# EAGLE design Esquema (EAGLE 9.6.2)
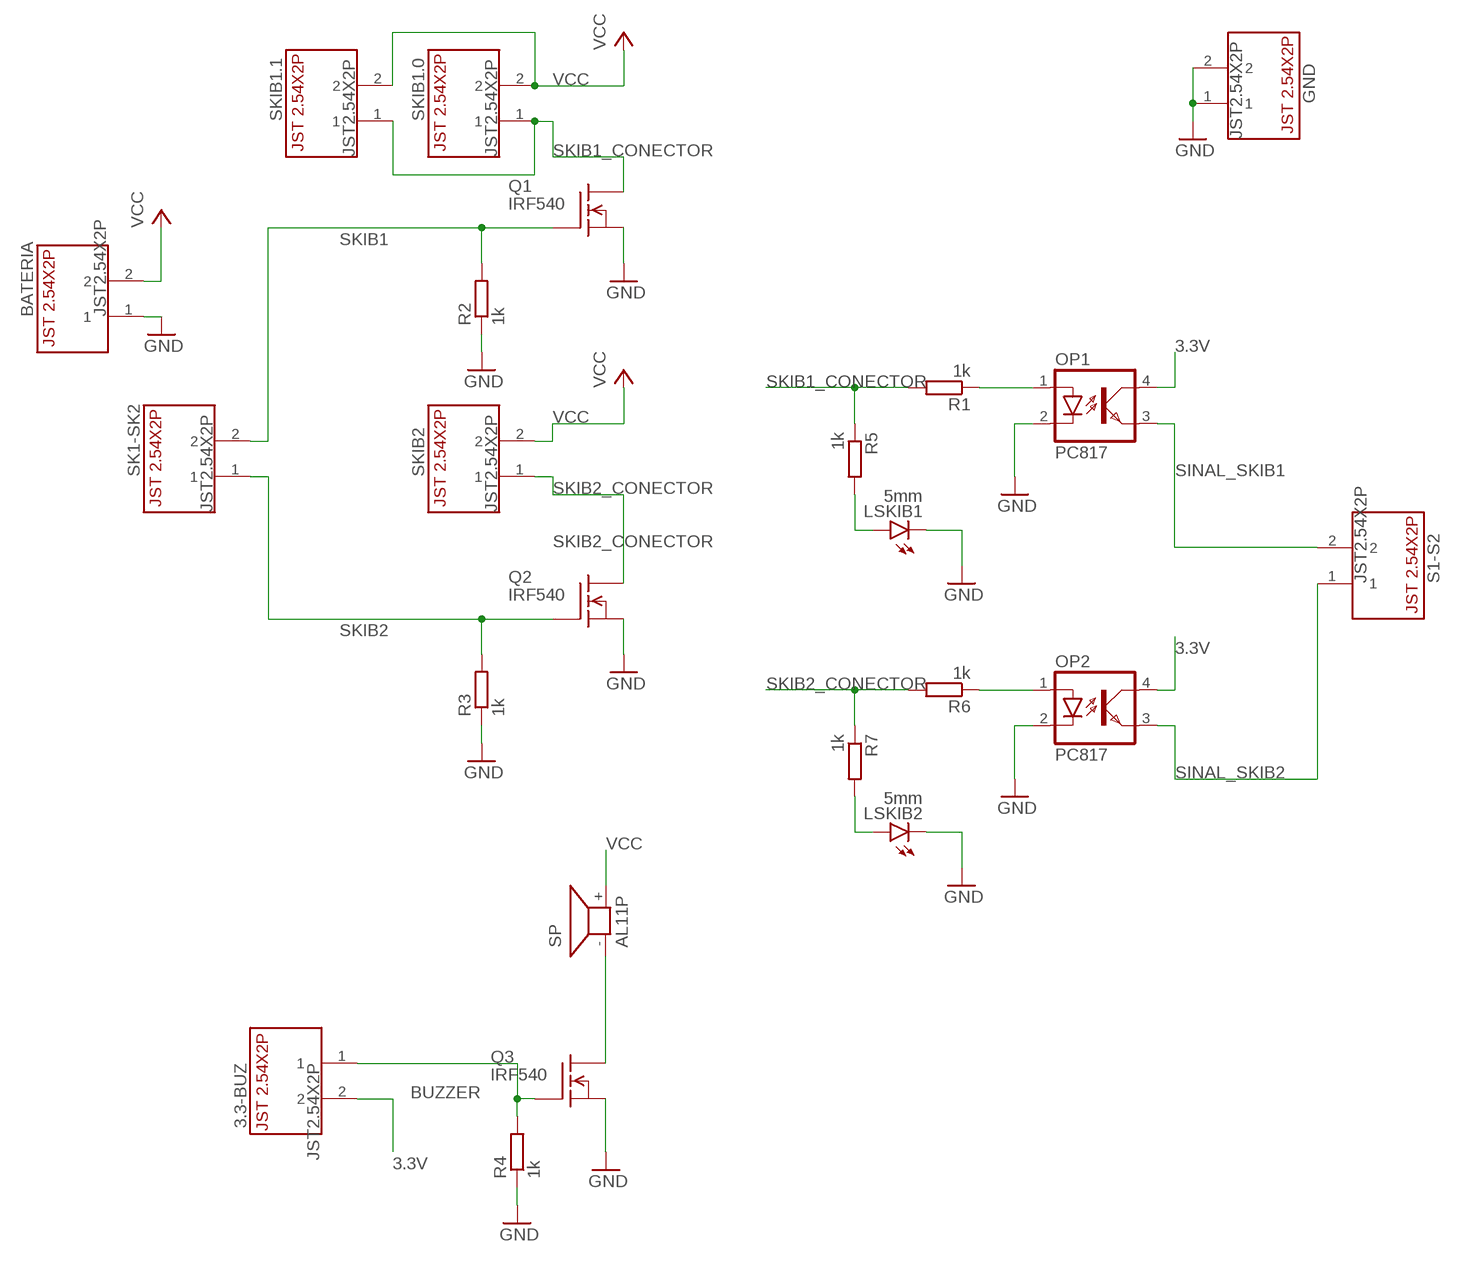
[diagram p0: schematic, sheet 1]

## Parts
3.3-BUZ  JST2.54X2P  [JST2.54X2P_FOOTPRINT]
BATERIA  JST2.54X2P  [JST2.54X2P_FOOTPRINT]
GND  JST2.54X2P  [JST2.54X2P_FOOTPRINT]
LSKIB1  5mm  LED5MM  [LED5MM]
LSKIB2  5mm  LED5MM  [LED5MM]
OP1  PC817  [DIL04]
OP2  PC817  [DIL04]
Q1  IRF540  [TO220]
Q2  IRF540  [TO220]
Q3  IRF540  [TO220]
R1  1k  R-EU_0207/10  [0207/10]
R2  1k  R-EU_0207/10  [0207/10]
R3  1k  R-EU_0207/10  [0207/10]
R4  1k  R-EU_0207/10  [0207/10]
R5  1k  R-EU_0207/10  [0207/10]
R6  1k  R-EU_0207/10  [0207/10]
R7  1k  R-EU_0207/10  [0207/10]
S1-S2  JST2.54X2P  [JST2.54X2P_FOOTPRINT]
SK1-SK2  JST2.54X2P  [JST2.54X2P_FOOTPRINT]
SKIB1.0  JST2.54X2P  [JST2.54X2P_FOOTPRINT]
SKIB1.1  JST2.54X2P  [JST2.54X2P_FOOTPRINT]
SKIB2  JST2.54X2P  [JST2.54X2P_FOOTPRINT]
SP  AL11P  [AL11P]

## Nets
3.3V: 3.3-BUZ.2 OP1.4(COL) OP2.4(COL)
BUZZER: 3.3-BUZ.1 Q3.1(G) R4.2
GND: BATERIA.1 GND.1 GND.2 LSKIB1.K(C) LSKIB2.K(C) OP1.2(C) OP2.2(C) Q1.3(S) Q2.3(S) Q3.3(S) R2.1 R3.1 R4.1
N$1: LSKIB2.A R7.2
N$2: Q3.2(D) SP.-
N$3: LSKIB1.A R5.2
N$4: OP1.1(A) R1.1
N$5: OP2.1(A) R6.1
SINAL_SKIB1: OP1.3(EMIT) S1-S2.2
SINAL_SKIB2: OP2.3(EMIT) S1-S2.1
SKIB1: Q1.1(G) R2.2 SK1-SK2.2
SKIB1_CONECTOR: Q1.2(D) R1.2 R5.1 SKIB1.0.1 SKIB1.1.1
SKIB2: Q2.1(G) R3.2 SK1-SK2.1
SKIB2_CONECTOR: Q2.2(D) R6.2 R7.1 SKIB2.1
VCC: BATERIA.2 SKIB1.0.2 SKIB1.1.2 SKIB2.2 SP.+

## Library data of the parts
3.3-BUZ BATERIA GND S1-S2 SK1-SK2 SKIB1.0 SKIB1.1 SKIB2 = CRD:JST2.54X2P: Conector JST 2 pinos (2.54mm de distância entre pinos)
LSKIB1 LSKIB2 = led-modificada:LED: LED OSRAM: - CHIPLED LG R971, LG N971, LY N971, LG Q971, LY Q971, LO R971, LY R971 LH N974, LH R974 LS Q976, LO Q976, LY Q976 LO Q996 - Hyper CHIPLED LW Q18S LB Q993, LB Q99A, LB R99A - SideLED LS A670, LO A670, LY A670, LG A670, LP A670 LB A673, LV A673, LT A673, LW A673 LH A674 LY A675 LS A676, LA A676, LO A676, LY A676, LW A676 LS A679, LY A679, LG A679 - Hyper Micro SIDELED® LS Y876, LA Y876, LO Y876, LY Y876 LT Y87S - SmartLED LW L88C, LW L88S LB L89C, LB L89S, LG L890 LS L89K, LO L89K, LY L89K LS L896, LA L896, LO L896, LY L896 - TOPLED LS T670, LO T670, LY T670, LG T670, LP T670 LSG T670, LSP T670, LSY T670, LOP T670, LYG T670 LG T671, LOG T671, LSG T671 LB T673, LV T673, LT T673, LW T673 LH T674 LS T676, LA T676, LO T676, LY T676, LB T676, LH T676, LSB T676, LW T676 LB T67C, LV T67C, LT T67C, LS T67K, LO T67K, LY T67K, LW E67C LS E67B, LA E67B, LO E67B, LY E67B, LB E67C, LV E67C, LT E67C LW T67C LS T679, LY T679, LG T679 LS T770, LO T770, LY T770, LG T770, LP T770 LB T773, LV T773, LT T773, LW T773 LH T774 LS E675, LA E675, LY E675, LS T675 LS T776, LA T776, LO T776, LY T776, LB T776 LHGB T686 LT T68C, LB T68C - Hyper Mini TOPLED® LB M676 - Mini TOPLED Santana® LG M470 LS M47K, LO M47K, LY M47K Source: http://www.osram.convergy.de LUXEON: - LUMILED® LXK2-PW12-R00, LXK2-PW12-S00, LXK2-PW14-U00, LXK2-PW14-V00 LXK2-PM12-R00, LXK2-PM12-S00, LXK2-PM14-U00 LXK2-PE12-Q00, LXK2-PE12-R00, LXK2-PE12-S00, LXK2-PE14-T00, LXK2-PE14-U00 LXK2-PB12-K00, LXK2-PB12-L00, LXK2-PB12-M00, LXK2-PB14-N00, LXK2-PB14-P00, LXK2-PB14-Q00 LXK2-PR12-L00, LXK2-PR12-M00, LXK2-PR14-Q00, LXK2-PR14-R00 LXK2-PD12-Q00, LXK2-PD12-R00, LXK2-PD12-S00 LXK2-PH12-R00, LXK2-PH12-S00 LXK2-PL12-P00, LXK2-PL12-Q00, LXK2-PL12-R00 Source: www.luxeon.com KINGBRIGHT: KA-3528ASYC Source: www.kingbright.com
OP1 OP2 = optocoupler:PC817: SHARP OPTO COUPLER; MPN: PC817X4J000F; OC_FARNELL: 9707727; OC_NEWARK: 97K7059
Q1-Q3 = transistor-fet:IRF540: N-Channel Enhancement MOSFET (HEXFET); 100V; 28A; 0,077Ohm
R1-R7 = rcl-modificada:R-EU_: RESISTOR, European symbol; SPICEPREFIX: R
SP = buzzer:AL11P: SPEAKER Source: Buerklin; OC_FARNELL: unknown; OC_NEWARK: unknown

## Board
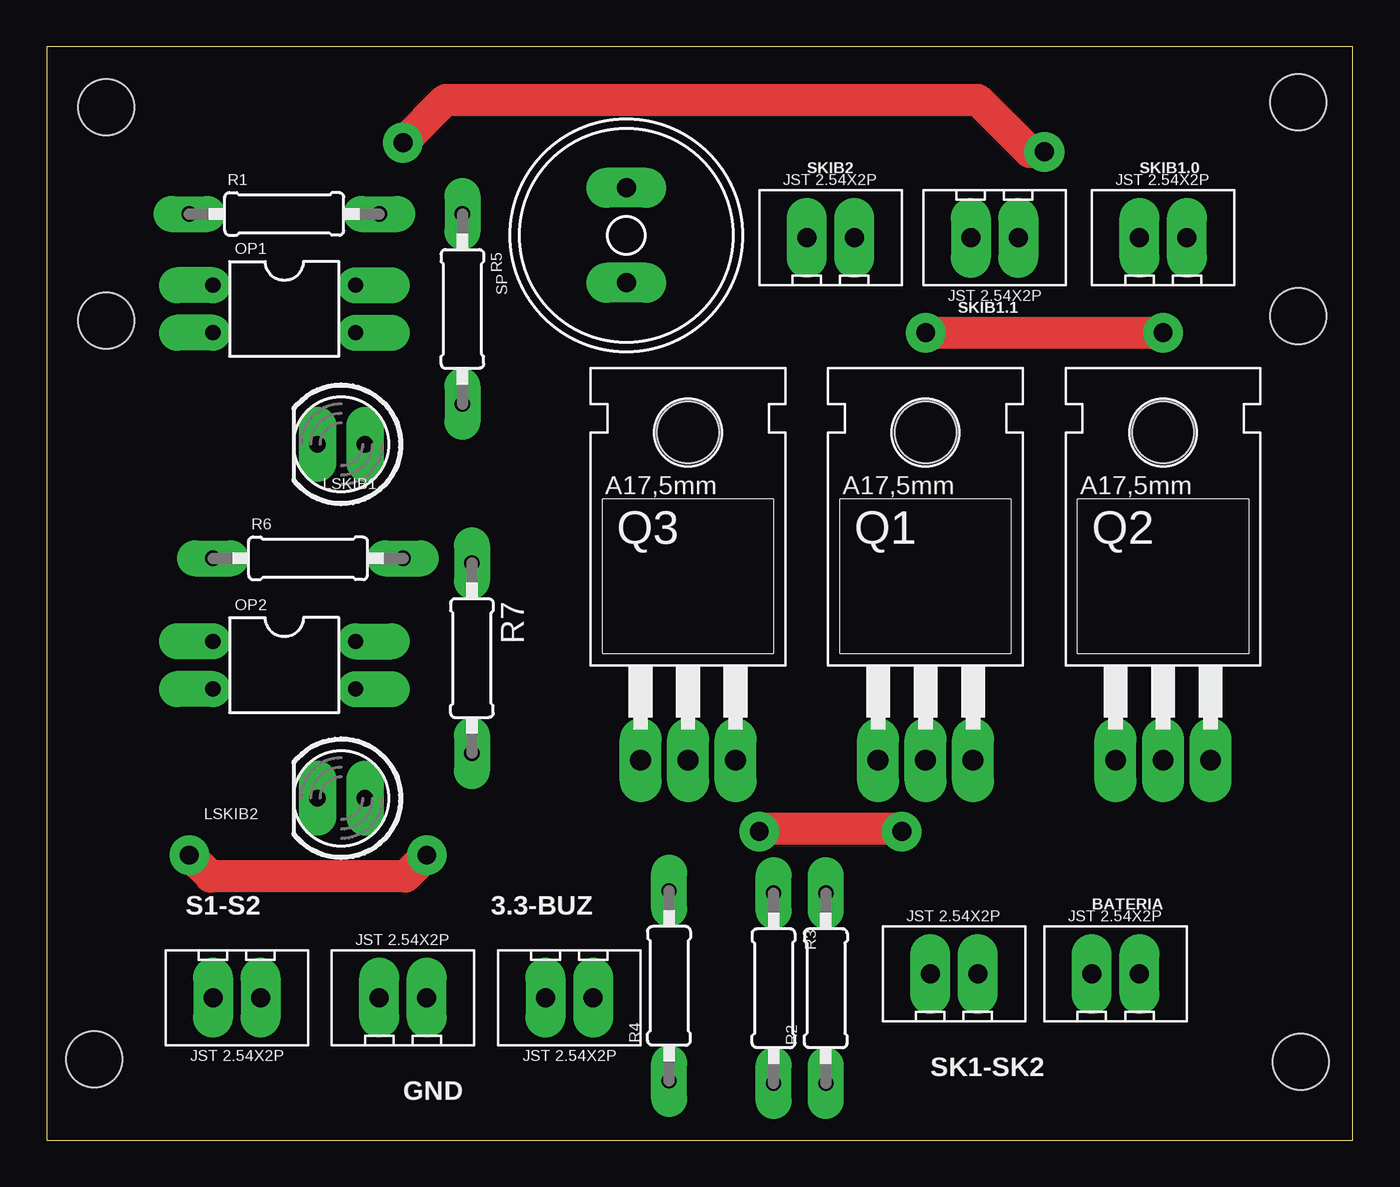
[diagram p1: board, top side]
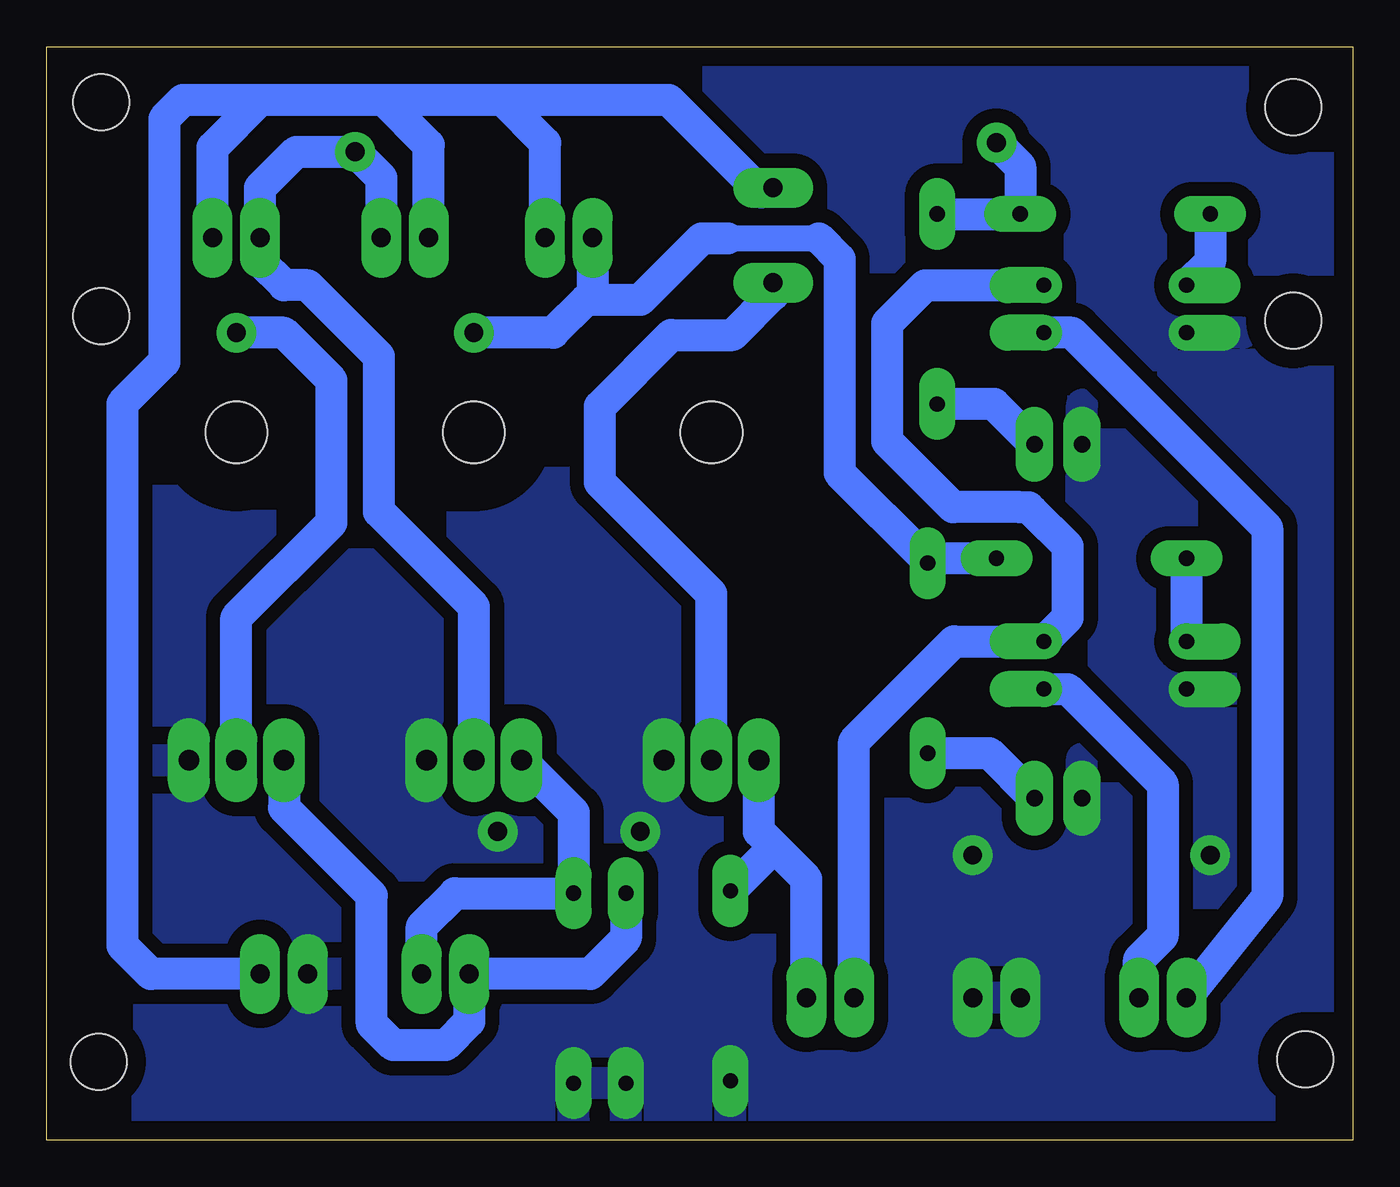
[diagram p2: board, bottom side, seen from below]

Size 69.83 x 58.47 mm. Coordinates in mm from the lower left corner, seen from the top.
Outline: 0,0 69.83,0 69.83,58.47 0,58.47 0,0
Copper layers (1*16): Top 0.035mm / dielectric 1.5mm / Bottom 0.035mm
Design rules "config": minimum track width 1.7mm, minimum drill 1mm, track to track 30mil, track to pad 20mil, pad to pad 6mil, via to via 6mil, smd to smd 6mil, copper to edge 40mil, drill to drill 6mil, minimum pad ring 22mil, minimum via ring 22mil, stop-mask expansion 4mil, vias tented up to drill 0mil, thermal gap 0mil
Holes 3 mm at 3.17,43.81 66.93,44.07 2.54,4.32 67.06,4.19 3.17,55.24 66.93,55.5

### Footprints (pad centres in the part's own frame; a part is rotated, then mirrored left to right if it is on the bottom)
JST2.54X2P_FOOTPRINT = drill 1.016 pad 1.27 long: 1 -1.27,0; 2 1.27,0
LED5MM = drill 0.889 pad 1.27 long: A -1.27,0; K 1.27,0
DIL04 = drill 0.813 offset: 1 -1.27,-3.81; 2 1.27,-3.81; 3 1.27,3.81; 4 -1.27,3.81
TO220 = drill 1.118 long: 1 -2.54,-6.35; 2 0,-6.35; 3 2.54,-6.35 | hole 3.302: 0,11.176
0207/10 = drill 0.813 long: 1 -5.08,0; 2 5.08,0
AL11P = drill 1.016 pad 1.397 long: + 2.54,0; - -2.54,0

### Placement (x,y rotation side)
3.3-BUZ  27.94,7.62 180 top
BATERIA  57.15,8.89 0 top
GND  19.05,7.62 0 top
LSKIB1  15.75,37.21 180 top
LSKIB2  15.75,18.29 180 top
OP1  12.7,44.45 270 top
OP2  12.7,25.4 270 top
Q1  46.99,26.67 0 top
Q2  59.69,26.67 0 top
Q3  34.29,26.67 0 top
R1  12.7,49.53 0 top
R2  41.66,8.13 90 top
R3  38.86,8.13 90 top
R4  33.27,8.26 90 top
R5  22.23,44.45 270 top
R6  13.97,31.11 0 top
R7  22.73,25.78 270 top
S1-S2  10.16,7.62 180 top
SK1-SK2  48.51,8.89 0 top
SKIB1.0  59.69,48.26 0 top
SKIB1.1  50.67,48.26 180 top
SKIB2  41.91,48.26 0 top
SP  30.99,48.39 90 top

### Tracks (layer width: path | path; a pad name or v marks a point on that pad's centre or on a via)
3.3V
  Bottom 1.7: OP1.4 22.86,45.72 24.89,43.69 24.89,37.36 21.38,33.85 17.78,33.85 17.34,33.85 17.14,33.66 15.24,31.75 15.24,27.94 OP2.4 21.31,26.67 26.67,21.31 3.3-BUZ.2
BUZZER
  Bottom 1.7: Q3.1 31.75,16.51 30.92,15.68 | R4.2 30.92,15.68 | 3.3-BUZ.1 29.21,13.97 30.92,15.68
GND  (via drill 1)
  Top 1.7: v38.1,16.51 38.23,16.64 45.59,16.64 v45.72,16.51 | v20.32,15.24 19.18,14.1 8.76,14.1 v7.62,15.24
  pour Bottom: 0.38,58.04 0.38,0.38 69.47,0.38 69.47,58.04
N$1
  Bottom 1.7: R7.2 19.43,20.7 LSKIB2.A
N$2
  Bottom 1.7: Q3.2 34.29,29.21 40.26,35.18 40.26,39.24 36.45,43.05 33.15,43.05 30.99,45.21 SP.-
N$3
  Bottom 1.7: LSKIB1.A 19.18,39.37 R5.2
N$4
  Bottom 1.7: R1.1 7.62,46.99 OP1.1
N$5
  Bottom 1.7: R6.1 OP2.1
SINAL_SKIB1
  Bottom 1.7: S1-S2.2 4.57,13.02 4.57,32.74 15.01,43.18 OP1.3
SINAL_SKIB2
  Bottom 1.7: OP2.3 15.24,24.13 10.16,19.05 10.16,10.92 11.43,9.65 S1-S2.1
SKIB1
  Bottom 1.7: SK1-SK2.2 49.78,11.43 48.01,13.21 R2.2 41.66,17.53 Q1.1
SKIB1_CONECTOR  (via drill 1)
  Top 1.7: v19.05,53.34 21.34,55.63 49.78,55.63 52.55,52.86 v53.34,52.86
  Bottom 1.7: Q1.2 46.99,28.54 52.07,33.62 52.07,41.91 55.88,45.72 57.15,45.72 58.42,46.99 SKIB1.0.1 58.42,50.93 56.49,52.86 v53.34,52.86 52.07,51.59 51.94,51.46 SKIB1.1.1 | R5.1 R1.2 17.78,52.07 v19.05,53.34
SKIB2
  Bottom 1.7: Q2.1 57.15,17.78 52.45,13.08 52.45,6.22 51.31,5.08 48.51,5.08 47.24,6.35 SK1-SK2.1 40.77,8.89 38.86,10.79 R3.2
SKIB2_CONECTOR  (via drill 1)
  Top 1.7: v46.99,43.18 v59.69,43.18
  Bottom 1.4: 33.43,48.24 28.55,48.24
  Bottom 1.7: Q2.2 59.69,27.94 54.61,33.02 54.61,39.83 54.61,39.9 54.61,40.64 57.15,43.18 v59.69,43.18 | 28.55,48.24 27.43,47.12 27.43,35.69 22.86,31.11 R6.2 22.48,31.11 R7.1 | 41,44.93 38.1,44.93 34.8,48.24 33.43,48.24 | 41,44.93 42.75,43.18 v46.99,43.18 | SKIB2.1 40.64,45.29 41,44.93
VCC
  Bottom 1.7: SP.+ 31.62,50.67 36.58,55.63 45.47,55.63 | 58.42,55.63 62.54,55.63 63.55,54.61 63.55,41.62 65.79,39.39 65.79,10.41 64.26,8.89 BATERIA.2 | 58.42,55.63 51.82,55.63 | 51.82,55.63 45.47,55.63 | 51.82,55.63 49.4,53.21 SKIB1.1.2 | SKIB2.2 43.18,53.34 45.47,55.63 | SKIB1.0.2 60.96,53.09 58.42,55.63